# Altium schematic sheet Title.SchDoc
size Tabloid; Date: Date; Author: Author 1; DocumentNumber: 1; Revision: 1; SheetNumber: 1; SheetTotal: 7; Size: 11x17; Sheet_Name: Title; Project_Name: Charge Station; Project_Global: SecurBot; ProjectName: Charge Station
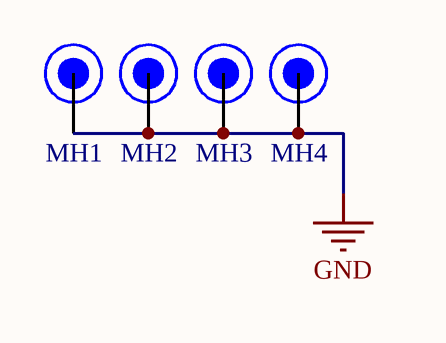
[diagram p0: Title.SchDoc]

## Parts
MH1  Mounting Hole 6/32  [MH_ENG_6-32]  (value not drawn)
MH2  Mounting Hole 6/32  [MH_ENG_6-32]  (value not drawn)
MH3  Mounting Hole 6/32  [MH_ENG_6-32]  (value not drawn)
MH4  Mounting Hole 6/32  [MH_ENG_6-32]  (value not drawn)

## Nets
GND: MH1.1 MH2.1 MH3.1 MH4.1

## Notes on the sheet
- Revision history
- Package size conversion
- Metric
- 1005
- 1608
- Imperial
- 0402
- 0603
- Revision
- 2012
- 3216
- 0805
- 1206
- 3225
- 6432
- 1210
- 2512
- Date :
- Project Title
- Global Project
- Size
- Group
- Date
- Sheet
- of
- Filename
- Designers

## Library data of the parts
MH1-MH4 = MH - 6-32